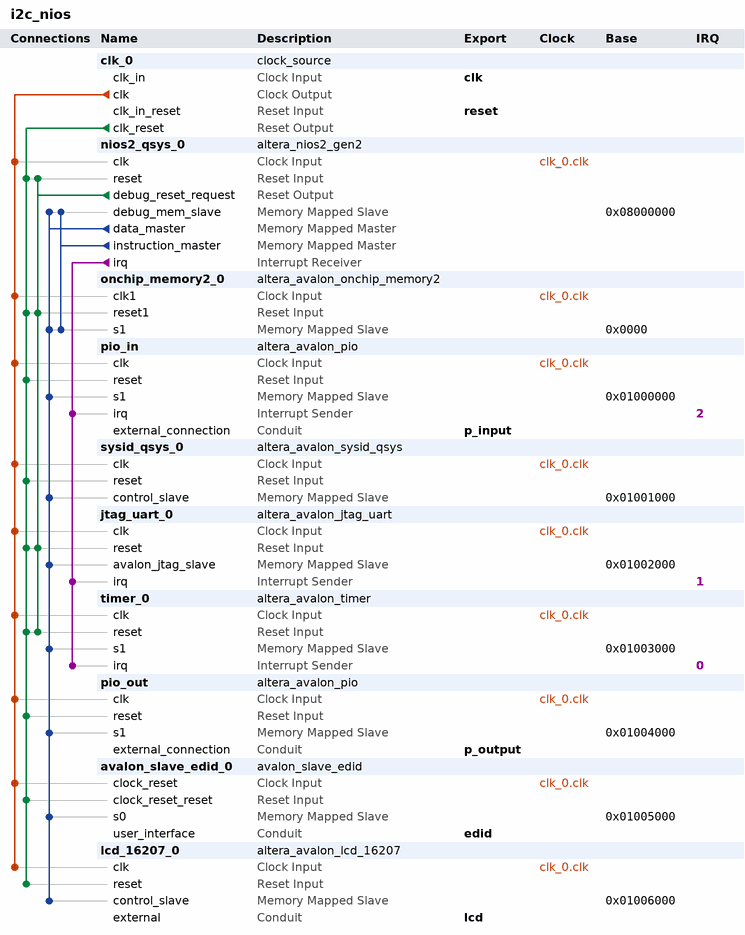
[diagram p0: system contents]
# Platform Designer (Qsys) system i2c_nios, Cyclone IV GX EP4CGX150DF31C7
# Parameters at their usual value, and those the tool derives, are not listed.
package require -exact qsys 15.0
create_system i2c_nios
set_project_property DEVICE_FAMILY {Cyclone IV GX}
set_project_property DEVICE EP4CGX150DF31C7

add_instance clk_0 clock_source 15.0
set_instance_parameter_value clk_0 clockFrequency 50000000

add_instance nios2_qsys_0 altera_nios2_gen2 15.0
set_instance_parameter_value nios2_qsys_0 dcache_size 0
set_instance_parameter_value nios2_qsys_0 debug_datatrigger 2
set_instance_parameter_value nios2_qsys_0 debug_hwbreakpoint 2
set_instance_parameter_value nios2_qsys_0 exceptionSlave onchip_memory2_0.s1
set_instance_parameter_value nios2_qsys_0 icache_size 2048
set_instance_parameter_value nios2_qsys_0 impl Fast
set_instance_parameter_value nios2_qsys_0 resetSlave onchip_memory2_0.s1
set_instance_parameter_value nios2_qsys_0 setting_activateTrace true
set_instance_parameter_value nios2_qsys_0 setting_branchpredictiontype Static

add_instance onchip_memory2_0 altera_avalon_onchip_memory2 15.0
set_instance_parameter_value onchip_memory2_0 allowInSystemMemoryContentEditor true
set_instance_parameter_value onchip_memory2_0 dataWidth 32
set_instance_parameter_value onchip_memory2_0 dualPort false
set_instance_parameter_value onchip_memory2_0 initMemContent true
set_instance_parameter_value onchip_memory2_0 initializationFileName "E:\\Projects\\DE2iBasedDanmaku\\danmaku_de2\\software\\nios_fw\\nios_fw.hex"
set_instance_parameter_value onchip_memory2_0 instanceID NIOS
set_instance_parameter_value onchip_memory2_0 memorySize 65536

add_instance pio_in altera_avalon_pio 15.0
set_instance_parameter_value pio_in captureEdge true
set_instance_parameter_value pio_in direction Input
set_instance_parameter_value pio_in generateIRQ true
set_instance_parameter_value pio_in irqType EDGE
set_instance_parameter_value pio_in width 8

add_instance sysid_qsys_0 altera_avalon_sysid_qsys 15.0
set_instance_parameter_value sysid_qsys_0 id -1412591607

add_instance jtag_uart_0 altera_avalon_jtag_uart 15.0
set_instance_parameter_value jtag_uart_0 simInteractiveOptions INTERACTIVE_ASCII_OUTPUT

add_instance timer_0 altera_avalon_timer 15.0
set_instance_parameter_value timer_0 period 1
set_instance_parameter_value timer_0 periodUnits MSEC

add_instance pio_out altera_avalon_pio 15.0
set_instance_parameter_value pio_out direction Output
set_instance_parameter_value pio_out width 8

add_instance avalon_slave_edid_0 avalon_slave_edid 1.1
set_instance_parameter_value avalon_slave_edid_0 DATA_WIDTH 8

add_instance lcd_16207_0 altera_avalon_lcd_16207 15.0

# connections
add_connection clk_0.clk avalon_slave_edid_0.clock_reset clock
add_connection clk_0.clk jtag_uart_0.clk clock
add_connection clk_0.clk lcd_16207_0.clk clock
add_connection clk_0.clk nios2_qsys_0.clk clock
add_connection clk_0.clk onchip_memory2_0.clk1 clock
add_connection clk_0.clk pio_in.clk clock
add_connection clk_0.clk pio_out.clk clock
add_connection clk_0.clk sysid_qsys_0.clk clock
add_connection clk_0.clk timer_0.clk clock
add_connection clk_0.clk_reset avalon_slave_edid_0.clock_reset_reset reset
add_connection clk_0.clk_reset jtag_uart_0.reset reset
add_connection clk_0.clk_reset lcd_16207_0.reset reset
add_connection clk_0.clk_reset nios2_qsys_0.reset reset
add_connection clk_0.clk_reset onchip_memory2_0.reset1 reset
add_connection clk_0.clk_reset pio_in.reset reset
add_connection clk_0.clk_reset pio_out.reset reset
add_connection clk_0.clk_reset sysid_qsys_0.reset reset
add_connection clk_0.clk_reset timer_0.reset reset
add_connection nios2_qsys_0.debug_reset_request jtag_uart_0.reset reset
add_connection nios2_qsys_0.debug_reset_request nios2_qsys_0.reset reset
add_connection nios2_qsys_0.debug_reset_request onchip_memory2_0.reset1 reset
add_connection nios2_qsys_0.debug_reset_request timer_0.reset reset
add_connection nios2_qsys_0.data_master avalon_slave_edid_0.s0 avalon
set_connection_parameter_value nios2_qsys_0.data_master/avalon_slave_edid_0.s0 baseAddress 0x01005000
add_connection nios2_qsys_0.data_master jtag_uart_0.avalon_jtag_slave avalon
set_connection_parameter_value nios2_qsys_0.data_master/jtag_uart_0.avalon_jtag_slave baseAddress 0x01002000
add_connection nios2_qsys_0.data_master lcd_16207_0.control_slave avalon
set_connection_parameter_value nios2_qsys_0.data_master/lcd_16207_0.control_slave baseAddress 0x01006000
add_connection nios2_qsys_0.data_master nios2_qsys_0.debug_mem_slave avalon
set_connection_parameter_value nios2_qsys_0.data_master/nios2_qsys_0.debug_mem_slave baseAddress 0x08000000
add_connection nios2_qsys_0.data_master onchip_memory2_0.s1 avalon
set_connection_parameter_value nios2_qsys_0.data_master/onchip_memory2_0.s1 baseAddress 0x0000
add_connection nios2_qsys_0.data_master pio_in.s1 avalon
set_connection_parameter_value nios2_qsys_0.data_master/pio_in.s1 baseAddress 0x01000000
add_connection nios2_qsys_0.data_master pio_out.s1 avalon
set_connection_parameter_value nios2_qsys_0.data_master/pio_out.s1 baseAddress 0x01004000
add_connection nios2_qsys_0.data_master sysid_qsys_0.control_slave avalon
set_connection_parameter_value nios2_qsys_0.data_master/sysid_qsys_0.control_slave baseAddress 0x01001000
add_connection nios2_qsys_0.data_master timer_0.s1 avalon
set_connection_parameter_value nios2_qsys_0.data_master/timer_0.s1 baseAddress 0x01003000
add_connection nios2_qsys_0.instruction_master nios2_qsys_0.debug_mem_slave avalon
set_connection_parameter_value nios2_qsys_0.instruction_master/nios2_qsys_0.debug_mem_slave baseAddress 0x08000000
add_connection nios2_qsys_0.instruction_master onchip_memory2_0.s1 avalon
set_connection_parameter_value nios2_qsys_0.instruction_master/onchip_memory2_0.s1 baseAddress 0x0000
add_connection nios2_qsys_0.irq jtag_uart_0.irq interrupt
set_connection_parameter_value nios2_qsys_0.irq/jtag_uart_0.irq irqNumber 1
add_connection nios2_qsys_0.irq pio_in.irq interrupt
set_connection_parameter_value nios2_qsys_0.irq/pio_in.irq irqNumber 2
add_connection nios2_qsys_0.irq timer_0.irq interrupt
set_connection_parameter_value nios2_qsys_0.irq/timer_0.irq irqNumber 0

# exported interfaces
add_interface clk clock sink
set_interface_property clk EXPORT_OF clk_0.clk_in
add_interface edid conduit end
set_interface_property edid EXPORT_OF avalon_slave_edid_0.user_interface
add_interface lcd conduit end
set_interface_property lcd EXPORT_OF lcd_16207_0.external
add_interface p_input conduit end
set_interface_property p_input EXPORT_OF pio_in.external_connection
add_interface p_output conduit end
set_interface_property p_output EXPORT_OF pio_out.external_connection
add_interface reset reset sink
set_interface_property reset EXPORT_OF clk_0.clk_in_reset

set_interconnect_requirement {$system} qsys_mm.clockCrossingAdapter HANDSHAKE
set_interconnect_requirement {$system} qsys_mm.maxAdditionalLatency 1

save_system i2c_nios.qsys
